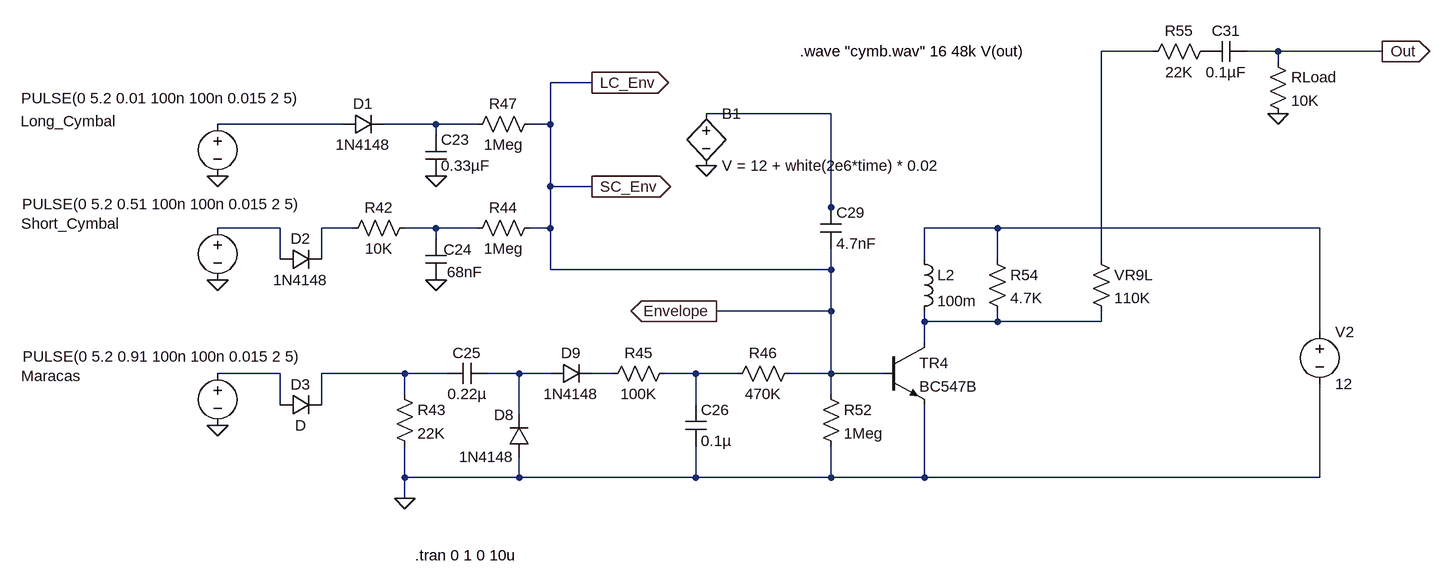
[diagram p0: schematic Practical-Electronics-1978-01_Pagina_24_Fig6_bottom.asc]
Practical-Electronics-1978-01_Pagina_24_Fig6_bottom.asc, the LTspice schematic file:
Version 4.1
SHEET 1 1636 680
WIRE 1184 -400 1104 -400
WIRE 1376 -400 1328 -400
WIRE 1536 -400 1376 -400
WIRE 1376 -384 1376 -400
WIRE 320 -352 256 -352
WIRE 688 -304 496 -304
WIRE -64 -288 -256 -288
WIRE 80 -288 0 -288
WIRE 144 -288 80 -288
WIRE 256 -288 256 -352
WIRE 256 -288 224 -288
WIRE 80 -272 80 -288
WIRE 256 -192 256 -288
WIRE 320 -192 256 -192
WIRE 688 -160 688 -304
WIRE 688 -144 688 -160
WIRE -160 -128 -256 -128
WIRE -48 -128 -96 -128
WIRE 80 -128 32 -128
WIRE 144 -128 80 -128
WIRE 256 -128 256 -192
WIRE 256 -128 224 -128
WIRE 944 -128 832 -128
WIRE 1440 -128 944 -128
WIRE 80 -112 80 -128
WIRE -160 -80 -160 -128
WIRE -96 -80 -96 -128
WIRE 832 -80 832 -128
WIRE 944 -80 944 -128
WIRE 1104 -80 1104 -400
WIRE 256 -64 256 -128
WIRE 688 -64 688 -96
WIRE 688 -64 256 -64
WIRE 688 0 688 -64
WIRE 688 0 512 0
WIRE 832 16 832 0
WIRE 944 16 944 0
WIRE 944 16 832 16
WIRE 1104 16 1104 0
WIRE 1104 16 944 16
WIRE 1440 32 1440 -128
WIRE 832 48 832 16
WIRE -160 96 -256 96
WIRE 32 96 -96 96
WIRE 96 96 32 96
WIRE 208 96 160 96
WIRE 256 96 208 96
WIRE 352 96 320 96
WIRE 480 96 432 96
WIRE 544 96 480 96
WIRE 688 96 688 0
WIRE 688 96 624 96
WIRE 768 96 688 96
WIRE 32 128 32 96
WIRE 688 128 688 96
WIRE -160 144 -160 96
WIRE -96 144 -96 96
WIRE 480 144 480 96
WIRE 208 160 208 96
WIRE 32 256 32 208
WIRE 208 256 208 224
WIRE 208 256 32 256
WIRE 480 256 480 208
WIRE 480 256 208 256
WIRE 688 256 688 208
WIRE 688 256 480 256
WIRE 832 256 832 144
WIRE 832 256 688 256
WIRE 1440 256 1440 112
WIRE 1440 256 832 256
WIRE 32 288 32 256
FLAG 32 288 0
FLAG 512 0 Envelope
IOPIN 512 0 Out
FLAG 1536 -400 Out
IOPIN 1536 -400 Out
FLAG 496 -224 0
FLAG 1376 -304 0
FLAG 80 -48 0
FLAG -256 -208 0
FLAG -256 -48 0
FLAG -256 176 0
FLAG 320 -352 LC_Env
IOPIN 320 -352 Out
FLAG 320 -192 SC_Env
IOPIN 320 -192 Out
FLAG 80 -208 0
SYMBOL res 16 112 R0
SYMATTR InstName R43
SYMATTR Value 22K
SYMBOL cap 160 80 R90
WINDOW 0 0 32 VBottom 2
WINDOW 3 32 32 VTop 2
SYMATTR InstName C25
SYMATTR Value 0.22µ
SYMATTR SpiceLine V=50
SYMBOL diode 256 112 R270
WINDOW 0 32 32 VTop 2
WINDOW 3 0 32 VBottom 2
SYMATTR InstName D9
SYMATTR Value 1N4148
SYMBOL diode 224 224 R180
WINDOW 0 24 64 Left 2
WINDOW 3 24 0 Left 2
SYMATTR InstName D8
SYMATTR Value 1N4148
SYMBOL res 448 80 R90
WINDOW 0 0 56 VBottom 2
WINDOW 3 32 56 VTop 2
SYMATTR InstName R45
SYMATTR Value 100K
SYMATTR SpiceLine tol=1 pwr=0.1
SYMBOL cap 464 144 R0
SYMATTR InstName C26
SYMATTR Value 0.1µ
SYMATTR SpiceLine V=50
SYMBOL res 640 80 R90
WINDOW 0 0 56 VBottom 2
WINDOW 3 32 56 VTop 2
SYMATTR InstName R46
SYMATTR Value 470K
SYMBOL res 672 112 R0
SYMATTR InstName R52
SYMATTR Value 1Meg
SYMATTR SpiceLine tol=1 pwr=0.1
SYMBOL voltage -256 80 R0
WINDOW 3 -300 -10 Left 2
WINDOW 123 0 0 Left 0
WINDOW 39 0 0 Left 0
WINDOW 0 -302 20 Left 2
SYMATTR Value PULSE(0 5.2 0.91 100n 100n 0.015 2 5)
SYMATTR InstName Maracas
SYMBOL npn3 768 48 R0
SYMATTR InstName TR4
SYMATTR Value BC547B
SYMBOL ind 816 -96 R0
SYMATTR InstName L2
SYMATTR Value 100m
SYMATTR SpiceLine Ipk=0.099 Rser=61.662 Rpar=9.42e+06 Cpar=0 mfg="Coilcraft" pn="PCH-45X-107"
SYMBOL res 928 -96 R0
SYMATTR InstName R54
SYMATTR Value 4.7K
SYMBOL voltage 1440 16 R0
WINDOW 123 0 0 Left 0
WINDOW 39 0 0 Left 0
SYMATTR InstName V2
SYMATTR Value 12
SYMBOL bv 496 -320 R0
SYMATTR InstName B1
SYMATTR Value V = 12 + white(2e6*time) * 0.02
SYMBOL cap 1328 -416 R90
WINDOW 0 0 32 VBottom 2
WINDOW 3 32 32 VTop 2
SYMATTR InstName C31
SYMATTR Value 0.1µF
SYMBOL res 1280 -416 R90
WINDOW 0 0 56 VBottom 2
WINDOW 3 32 56 VTop 2
SYMATTR InstName R55
SYMATTR Value 22K
SYMBOL res 1360 -400 R0
SYMATTR InstName RLoad
SYMATTR Value 10K
SYMBOL cap 672 -160 R0
SYMATTR InstName C29
SYMATTR Value 4.7nF
SYMBOL res 1088 -96 R0
SYMATTR InstName VR9L
SYMATTR Value 110K
SYMBOL res 48 -144 R90
WINDOW 0 0 56 VBottom 2
WINDOW 3 32 56 VTop 2
SYMATTR InstName R42
SYMATTR Value 10K
SYMATTR SpiceLine tol=1 pwr=0.1
SYMBOL res 240 -144 R90
WINDOW 0 0 56 VBottom 2
WINDOW 3 32 56 VTop 2
SYMATTR InstName R44
SYMATTR Value 1Meg
SYMBOL cap 64 -112 R0
WINDOW 0 28 17 Left 2
WINDOW 3 33 52 Left 2
SYMATTR InstName C24
SYMATTR Value 68nF
SYMBOL cap 64 -272 R0
WINDOW 3 24 48 Left 2
SYMATTR Value 0.33µF
SYMATTR InstName C23
SYMBOL res 240 -304 R90
WINDOW 0 0 56 VBottom 2
WINDOW 3 32 56 VTop 2
SYMATTR InstName R47
SYMATTR Value 1Meg
SYMBOL voltage -256 -304 R0
WINDOW 3 -302 -24 Left 2
WINDOW 123 0 0 Left 0
WINDOW 39 0 0 Left 0
WINDOW 0 -303 11 Left 2
SYMATTR Value PULSE(0 5.2 0.01 100n 100n 0.015 2 5)
SYMATTR InstName Long_Cymbal
SYMBOL voltage -256 -144 R0
WINDOW 0 -302 9 Left 2
WINDOW 3 -301 -21 Left 2
WINDOW 123 0 0 Left 0
WINDOW 39 -286 160 Left 2
SYMATTR InstName Short_Cymbal
SYMATTR Value PULSE(0 5.2 0.51 100n 100n 0.015 2 5)
SYMBOL diode -64 -272 R270
WINDOW 0 32 32 VTop 2
WINDOW 3 0 32 VBottom 2
SYMATTR InstName D1
SYMATTR Value 1N4148
SYMBOL diode -160 -64 R270
WINDOW 0 32 32 VTop 2
WINDOW 3 0 32 VBottom 2
SYMATTR InstName D2
SYMATTR Value 1N4148
SYMBOL diode -160 160 R270
WINDOW 0 32 32 VTop 2
WINDOW 3 0 32 VBottom 2
SYMATTR InstName D3
TEXT 48 376 Left 2 !.tran 0 1 0 10u
TEXT 640 -400 Left 2 !.wave "cymb.wav" 16 48k V(out)

The netlist it stands for:
* Practical-Electronics-1978-01_Pagina_24_Fig6_bottom.asc
R43 N011 0 22K
C25 N012 N011 0.22µ V=50
D9 N012 N013 1N4148
D8 0 N012 1N4148
R45 N014 N013 100K tol=1 pwr=0.1
C26 N014 0 0.1µ V=50
R46 SC_Env N014 470K
R52 SC_Env 0 1Meg tol=1 pwr=0.1
V§Maracas N010 0 PULSE(0 5.2 0.91 100n 100n 0.015 2 5)
Q§TR4 N009 SC_Env 0 0 BC547B
L2 N008 N009 100m Ipk=0.099 Rser=61.662 Rpar=9.42e+06 Cpar=0 mfg="Coilcraft" pn="PCH-45X-107"
R54 N008 N009 4.7K
V2 N008 0 12
B1 N002 0 V = 12 + white(2e6*time) * 0.02
C31 Out P001 0.1µF
R55 P001 N001 22K
RLoad Out 0 10K
C29 N002 SC_Env 4.7nF
R§VR9L N001 N009 110K
R42 N007 N006 10K tol=1 pwr=0.1
R44 SC_Env N007 1Meg
C24 N007 0 68nF
C23 N004 0 0.33µF
R47 SC_Env N004 1Meg
V§Long_Cymbal N003 0 PULSE(0 5.2 0.01 100n 100n 0.015 2 5)
V§Short_Cymbal N005 0 PULSE(0 5.2 0.51 100n 100n 0.015 2 5)
D1 N003 N004 1N4148
D2 N005 N006 1N4148
D3 N010 N011 D
.model D D
.lib standard.dio
.model NPN NPN
.model PNP PNP
.lib standard.bjt
.tran 0 1 0 10u
.wave "cymb.wav" 16 48k V(out)
.backanno
.end